# Altium schematic sheet СФ МЭИ ПЭ-25.11.04.04.09.01 Э3.SchDoc
size 594 x 420 mm; CheckedBy: Ковалева М.С.; Author: Чепурин В.Ю.; CompanyName: СФ МЭИ; SheetNumber: 1; SheetTotal: 1; DateCreate: 10.01.26; PageSetup: Record=PageOptions|CenterHorizontal=True|CenterVertical=True|PrintScale=0.94|XCorrection=1.00|YCorrection=1.00|PrintKind=1|BorderSize=5000000|LeftOffset=0|BottomOffset=0|Orientation=1|PaperLength=1000|PaperWidth=1000|Scale=100|PaperSource=7|PrintQuality=-4|MediaType=1|DitherType=10|PaperKind=A4|PrintScaleMode=1; DecimalNumber: СФ МЭИ ПЭ-25.11.04.04.09.01; Name1: Устройство измерения; n_kontr: Ковалева М.С.; lit_A: У; Name2: параметров микроклимата; Name3: с беспроводным интерфейсом; Group: гр. ПЭ-25з(Маг)
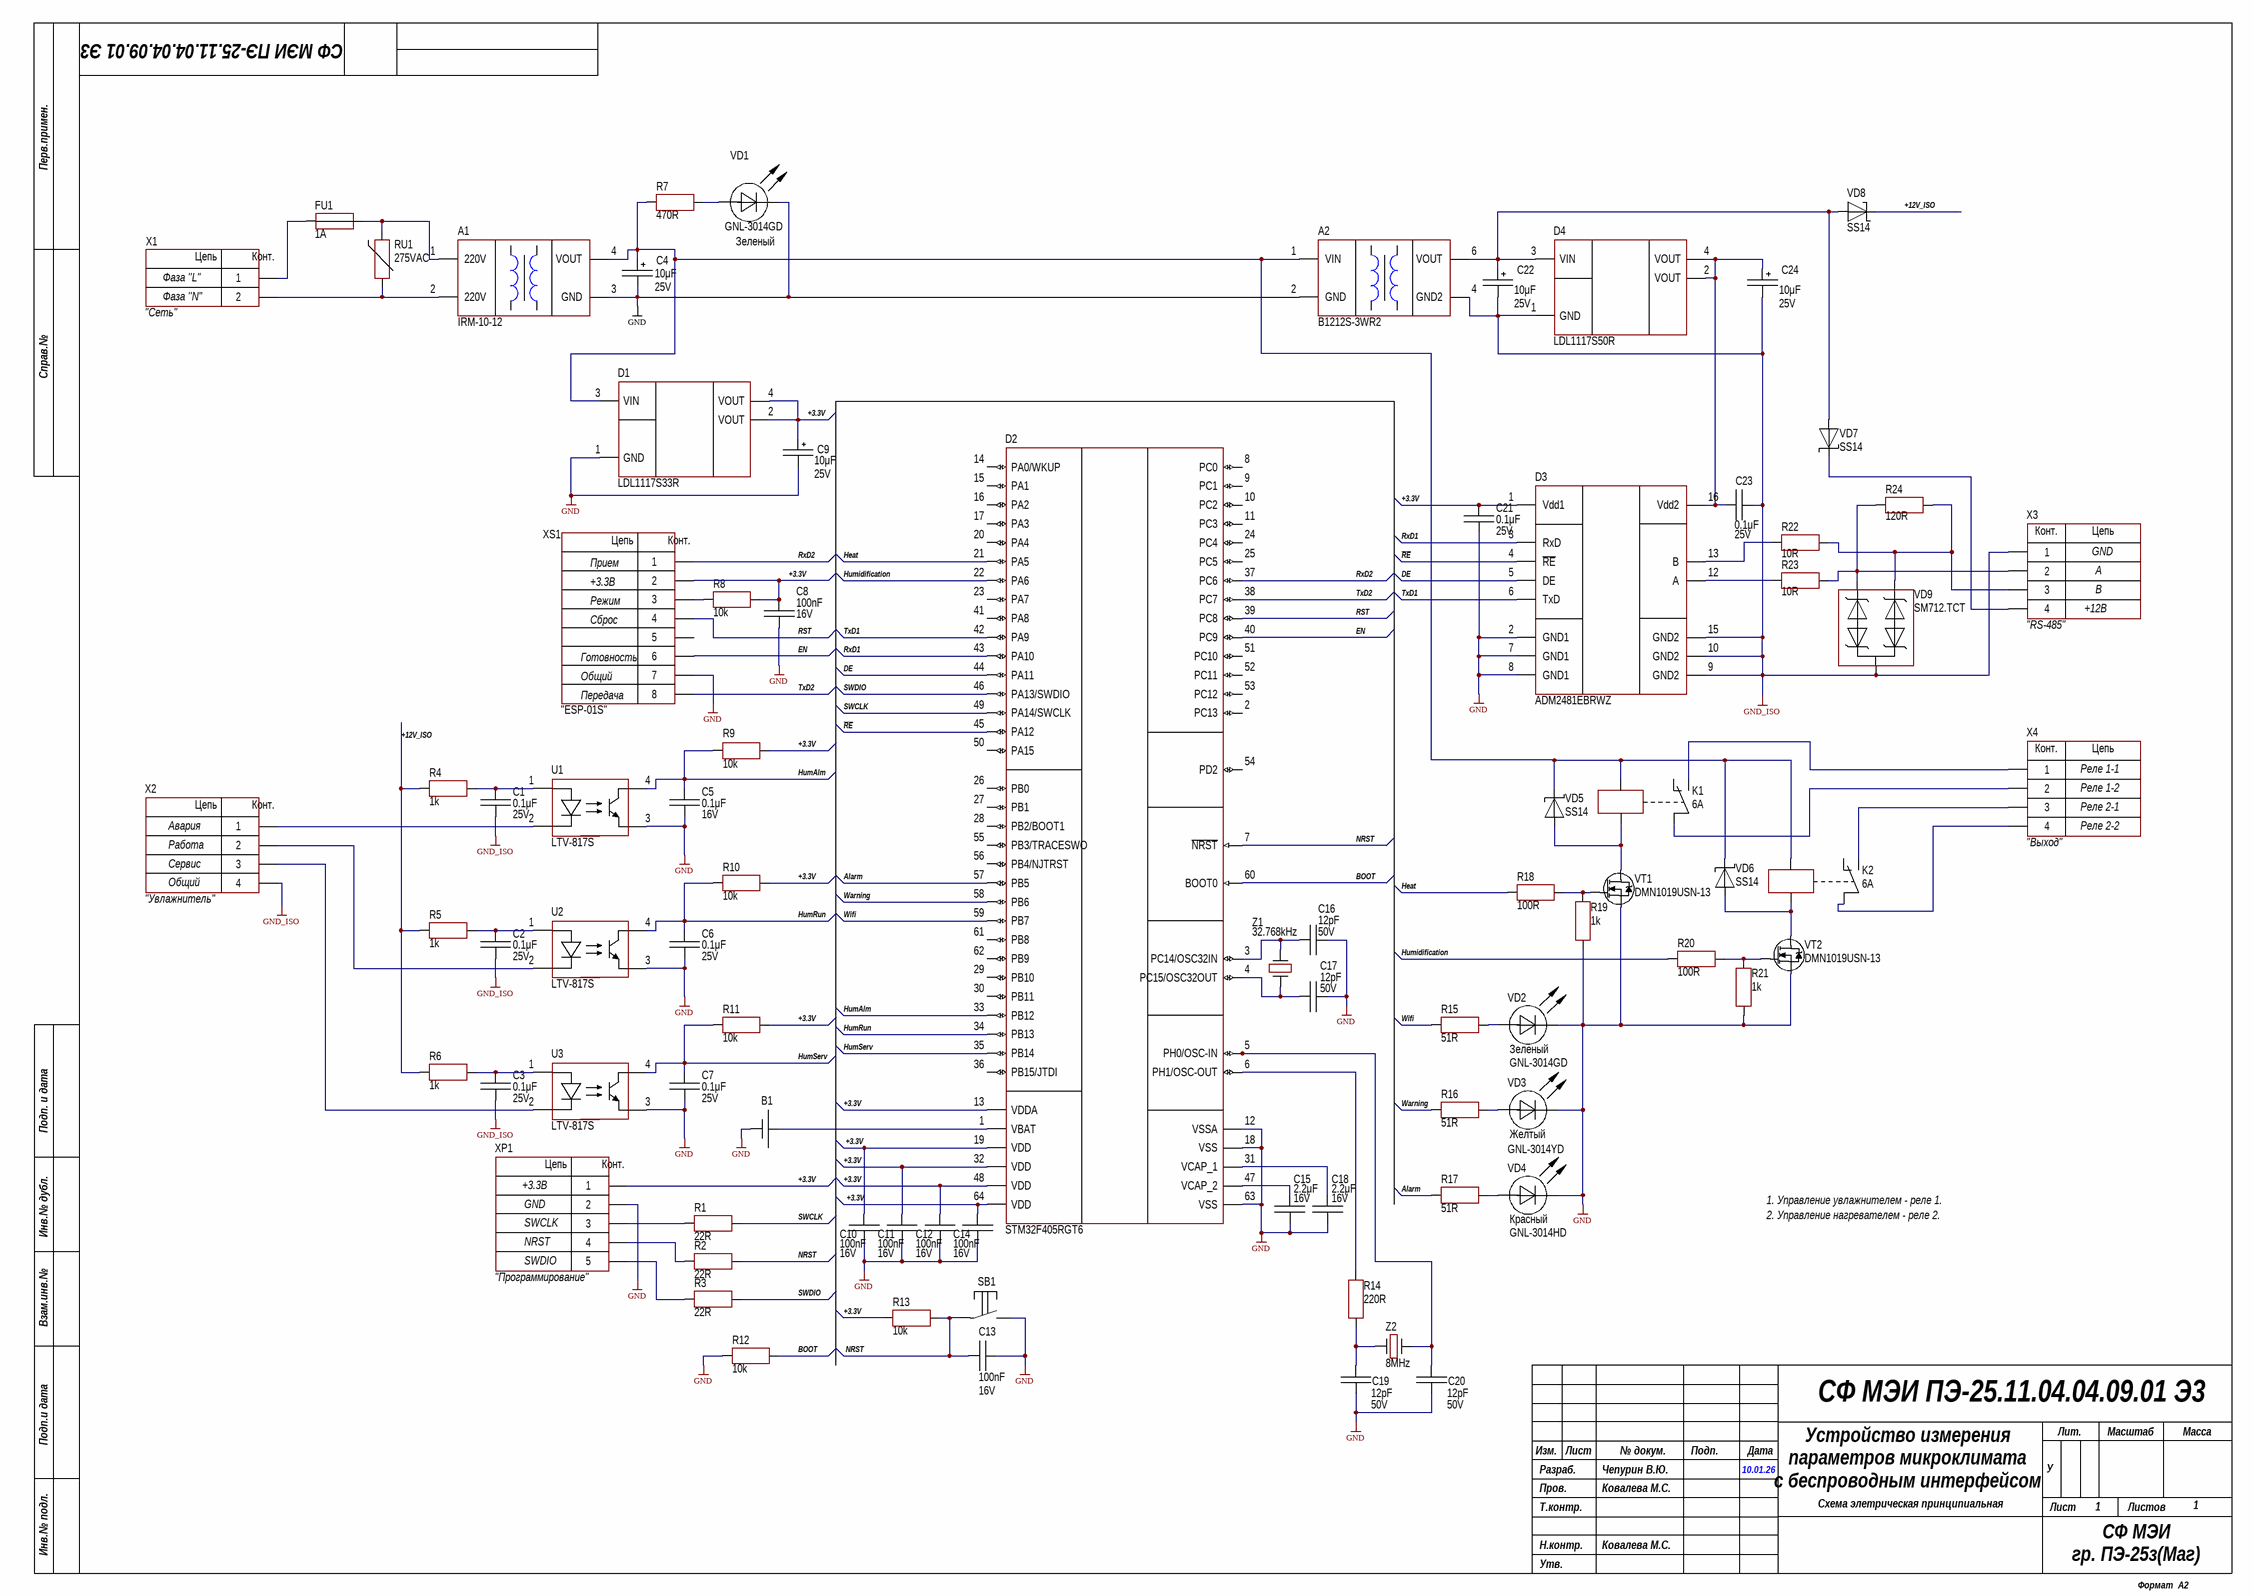
[diagram p0: СФ МЭИ ПЭ-25.11.04.04.09.01 Э3.SchDoc]

## Parts
A1  PartNumber: IRM-10-12  [MOD: IRM-10-12]  (hidden comment: AC/DC converter, isolator, 12V 850mA, 85...265VAC, -30...+70°C, 4-DIP)
A2  PartNumber: B1212S-3WR2  [MOD: SIP-7 (B1212S-2W)]
B1  (no value)  [BAT: CH224-2032]
C1  value 0.1μF  Voltage: 25V  [CAP: 0805]  (hidden comment: Ceramic capacitor, 0.1μF, X7R, ±10%, 16V, 0805, -55...+125°C)
C2  value 0.1μF  Voltage: 25V  [CAP: 0805]  (hidden comment: Ceramic capacitor, 0.1μF, X7R, ±10%, 16V, 0805, -55...+125°C)
C3  value 0.1μF  Voltage: 25V  [CAP: 0805]  (hidden comment: Ceramic capacitor, 0.1μF, X7R, ±10%, 16V, 0805, -55...+125°C)
C4  value 10μF  Voltage: 25V  [CAP: TANTAL-C]
C5  value 0.1μF  Voltage: 16V  [CAP: 0805]
C6  value 0.1μF  Voltage: 25V  [CAP: 0805]  (hidden comment: Ceramic capacitor, 0.1μF, X7R, ±10%, 16V, 0805, -55...+125°C)
C7  value 0.1μF  Voltage: 25V  [CAP: 0805]  (hidden comment: Ceramic capacitor, 0.1μF, X7R, ±10%, 16V, 0805, -55...+125°C)
C8  value 100nF  Voltage: 16V  [CAP: 0805]
C9  value 10μF  Voltage: 25V  [CAP: TANTAL-C]
C10  value 100nF  Voltage: 16V  [CAP: 0805]
C11  value 100nF  Voltage: 16V  [CAP: 0805]
C12  value 100nF  Voltage: 16V  [CAP: 0805]
C13  value 100nF  Voltage: 16V  [CAP: 0805]
C14  value 100nF  Voltage: 16V  [CAP: 0805]
C15  value 2.2μF  Voltage: 16V  [CAP: 0805]
C16  value 12pF  Voltage: 50V  [CAP: 0805]  (hidden comment: Ceramic capacitor, 6.8pF, X7R, ±10%, 16V, 0805, -55...+125°C)
C17  value 12pF  Voltage: 50V  [CAP: 0805]  (hidden comment: Ceramic capacitor, 6.8pF, X7R, ±10%, 16V, 0805, -55...+125°C)
C18  value 2.2μF  Voltage: 16V  [CAP: 0805]
C19  value 12pF  Voltage: 50V  [CAP: 0805]  (hidden comment: Ceramic capacitor, 6.8pF, X7R, ±10%, 16V, 0805, -55...+125°C)
C20  value 12pF  Voltage: 50V  [CAP: 0805]  (hidden comment: Ceramic capacitor, 6.8pF, X7R, ±10%, 16V, 0805, -55...+125°C)
C21  value 0.1μF  Voltage: 25V  [CAP: 0805]  (hidden comment: Ceramic capacitor, 0.1μF, X7R, ±10%, 16V, 0805, -55...+125°C)
C22  value 10μF  Voltage: 25V  [CAP: TANTAL-C]
C23  value 0.1μF  Voltage: 25V  [CAP: 0805]  (hidden comment: Ceramic capacitor, 0.1μF, X7R, ±10%, 16V, 0805, -55...+125°C)
C24  value 10μF  Voltage: 25V  [CAP: TANTAL-C]
D1  (no value)  [SOT223]
D2  (no value)  [64-LQFP]
D3  (no value)  [16-SOIC]
D4  PartNumber: LDL1117S50R  [SOT223]
FU1  Value current: 1A  [FUSE: 01110501Z (5x20 mm)]
K1  Value current: 6A  [REL: Ultra-thin relay, 5pin]
K2  Value current: 6A  [REL: Ultra-thin relay, 5pin]
R1  value 22R  [RES: 0805]
R2  value 22R  [RES: 0805]
R3  value 22R  [RES: 0805]
R4  value 1k  [RES: 0805]  (hidden comment: Resistor film, 560R, ±5%, 0805, 0.125W, -55...+125°C)
R5  value 1k  [RES: 0805]  (hidden comment: Resistor film, 560R, ±5%, 0805, 0.125W, -55...+125°C)
R6  value 1k  [RES: 0805]  (hidden comment: Resistor film, 560R, ±5%, 0805, 0.125W, -55...+125°C)
R7  value 470R  [RES: 0805]
R8  value 10k  [RES: 0805]
R9  value 10k  [RES: 0805]  (hidden comment: Resistor film, 1k, ±5%, 0805, 0.125W, -55...+125°C)
R10  value 10k  [RES: 0805]  (hidden comment: Resistor film, 1k, ±5%, 0805, 0.125W, -55...+125°C)
R11  value 10k  [RES: 0805]  (hidden comment: Resistor film, 1k, ±5%, 0805, 0.125W, -55...+125°C)
R12  value 10k  [RES: 0805]  (hidden comment: Resistor film, 1k, ±5%, 0805, 0.125W, -55...+125°C)
R13  value 10k  [RES: 0805]
R14  value 220R  [RES: 0805]
R15  value 51R  [RES: 0805]
R16  value 51R  [RES: 0805]
R17  value 51R  [RES: 0805]
R18  value 100R  [RES: 0805]
R19  value 1k  [RES: 0805]
R20  value 100R  [RES: 0805]
R21  value 1k  [RES: 0805]
R22  value 10R  [RES: 0805]
R23  value 10R  [RES: 0805]
R24  value 120R  [RES: 0805]
RU1  MaxVoltage: 275VAC  [RES: MOV-07D431K]
SB1  (no value)  [BUT: 6x6]
U1  PartNumber: LTV-817S  [4-SMD]
U2  PartNumber: LTV-817S  [4-SMD]
U3  PartNumber: LTV-817S  [4-SMD]
VD1  Color: Зеленый  [LED: Green, 3mm]
VD2  Color: Зеленый  [LED: Green, 3mm]
VD3  Color: Желтый  [LED: Yellow, 3mm]
VD4  Color: Красный  [LED: Red, 3mm]
VD5  (no value)  [DIODE: SMA]
VD6  (no value)  [DIODE: SMA]
VD7  (no value)  [DIODE: SMA]
VD8  (no value)  [DIODE: SMA]
VD9  (no value)  [SOT23]
VT1  (no value)  [SOT23]
VT2  (no value)  [SOT23]
X1  CommentText: "Сеть"  [CON: DG301-5.0-02P-12]
X2  CommentText: "Увлажнитель"  [CON: DG301-5.0-02P-12x2]
X3  CommentText: "RS-485"  [CON: DG301-5.0-02P-12x2]
X4  CommentText: "Выход"  [CON: DG301-5.0-02P-12x2]
XP1  CommentText: "Программирование"  [CON: PLS-5]
XS1  CommentText: "ESP-01S"  [CON: PBD-8]
Z1  Frequency: 32.768kHz  [OSC: 3215]
Z2  Frequency: 8MHz  [OSC: НС-49S]

## Nets
GND: A1.3(GND) A2.2(GND) B1.2(-) C4.2 C5.1 C6.1 C7.1 C8.1 C9.2 C10.1 C11.1 C12.1 C13.1 C14.1 C15.1 C16.2 C17.2 C18.1 C19.2 C20.2 C21.1 D1.1(GND) D2.12(VSSA) D2.18(VSS) D2.63(VSS) D3.2(GND1) D3.7(GND1) D3.8(GND1) R12.2 R19.2 R21.2 SB1.2 U1.3(E) U2.3(E) U3.3(E) VD1.2(C) VD2.2(C) VD3.2(C) VD4.2(C) VT1.2(S) VT2.2(S) XP1.2 XS1.7
GND_ISO: A2.4(GND2) C1.1 C2.1 C3.1 C22.2 C23.1 C24.2 D3.9(GND2) D3.10(GND2) D3.15(GND2) D4.1(GND) VD9.3 X2.4 X3.1
+3.3V: C8.2 C9.1 C10.2 C11.2 C12.2 C14.2 C21.2 D1.2(VOUT) D1.4(VOUT) D2.13(VDDA) D2.19(VDD) D2.32(VDD) D2.48(VDD) D2.64(VDD) D3.1(Vdd1) R8.1 R9.1 R10.1 R11.1 R13.2 XP1.1 XS1.2
+12V_ISO: R4.2 R5.2 R6.2 VD8.2
Alarm: D2.57(PB5) R17.2
BOOT: D2.60(BOOT0) R12.1
DE: D2.44(PA11) D3.5(DE)
EN: D2.40(PC9) XS1.6
Heat: D2.21(PA5) R18.2
HumAlm: C5.2 D2.33(PB12) R9.2 U1.4(C)
Humidification: D2.22(PA6) R20.2
HumRun: C6.2 D2.34(PB13) R10.2 U2.4(C)
HumServ: C7.2 D2.35(PB14) R11.2 U3.4(C)
NRST: C13.2 D2.7(~{NRST}) R2.1 R13.1 SB1.1
~{RE}: D2.45(PA12) D3.4(~{RE})
RST: D2.39(PC8) XS1.4
RxD1: D2.43(PA10) D3.3(RxD)
RxD2: D2.37(PC6) XS1.1
SWCLK: D2.49(PA14/SWCLK) R1.1
SWDIO: D2.46(PA13/SWDIO) R3.1
TxD1: D2.42(PA9) D3.6(TxD)
TxD2: D2.38(PC7) XS1.8
Warning: D2.58(PB6) R16.2
Wifi: D2.59(PB7) R15.2
NetA1_1: A1.1(220V) FU1.2 RU1.2
NetA1_2: A1.2(220V) RU1.1 X1.2
NetA1_4: A1.4(VOUT) A2.1(VIN) C4.1 D1.3(VIN) K1.2 K2.2 R7.2 VD5.2 VD6.2
NetA2_6: A2.6(VOUT) C22.1 D4.3(VIN) VD7.1 VD8.1
NetB1_1: B1.1(+) D2.1(VBAT)
NetC1_2: C1.2 R4.1 U1.1(A)
NetC2_2: C2.2 R5.1 U2.1(A)
NetC3_2: C3.2 R6.1 U3.1(A)
NetC15_2: C15.2 D2.47(VCAP_2)
NetC16_1: C16.1 D2.3(PC14/OSC32IN) Z1.2
NetC17_1: C17.1 D2.4(PC15/OSC32OUT) Z1.1
NetC18_2: C18.2 D2.31(VCAP_1)
NetC19_1: C19.1 R14.2 Z2.1
NetC20_1: C20.1 D2.5(PH0/OSC-IN) Z2.2
NetC23_2: C23.2 C24.1 D3.16(Vdd2) D4.2(VOUT) D4.4(VOUT)
NetD2_6: D2.6(PH1/OSC-OUT) R14.1
NetD3_12: D3.12(A) R23.2
NetD3_13: D3.13(B) R22.2
NetFU1_1: FU1.1 X1.1
NetK1_1: K1.1 VD5.1 VT1.3(D)
NetK1_3: K1.3 X4.2
NetK1_5: K1.5 X4.1
NetK2_1: K2.1 VD6.1 VT2.3(D)
NetK2_3: K2.3 X4.4
NetK2_5: K2.5 X4.3
NetR1_2: R1.2 XP1.3
NetR2_2: R2.2 XP1.4
NetR3_2: R3.2 XP1.5
NetR7_1: R7.1 VD1.1(A)
NetR8_2: R8.2 XS1.3
NetR15_1: R15.1 VD2.1(A)
NetR16_1: R16.1 VD3.1(A)
NetR17_1: R17.1 VD4.1(A)
NetR18_1: R18.1 R19.1 VT1.1(G)
NetR20_1: R20.1 R21.1 VT2.1(G)
NetR22_1: R22.1 R24.1 VD9.2 X3.3
NetR23_1: R23.1 R24.2 VD9.1 X3.2
NetU1_2: U1.2(C) X2.1
NetU2_2: U2.2(C) X2.2
NetU3_2: U3.2(C) X2.3
NetVD7_2: VD7.2 X3.4

Not connected (* = marked no-connect by the designer): D2 2(PC13) 8(PC0) 9(PC1) 10(PC2) 11(PC3) 14(PA0/WKUP) 15(PA1) 16(PA2) 17(PA3) 20(PA4) 23(PA7) 24(PC4) 25(PC5) 26(PB0) 27(PB1) 28(PB2/BOOT1) 29(PB10) 30(PB11) 36(PB15/JTDI) 41(PA8) 50(PA15) 51(PC10) 52(PC11) 53(PC12) 54(PD2) 55(PB3/TRACESWO) 56(PB4/NJTRST) 61(PB8) 62(PB9); K1 4; K2 4; XS1 5

## Notes on the sheet
- Фаза ''L"
- Фаза ''N"
- +3.3В
- Прием
- GND
- A
- B
- Сброс
- Режим
- +12В
- Общий
- Передача
- (near XS1) Готовность
- Реле 1-1
- Реле 1-2
- Авария
- Реле 2-1
- Реле 2-2
- Сервис
- Работа
- SWCLK
- 1. Управление увлажнителем - реле 1.
- 2. Управление нагревателем - реле 2.
- SWDIO
- NRST
- Перв.примен.
- Справ.№
- Подп. и дата
- Инв.№ дубл.
- Взам.инв.№
- Подп.и дата
- Разраб.
- Изм.
- Лист
- № докум.
- Подп.
- Дата
- Лит.
- Масштаб
- Масса
- Т.контр.
- Пров.
- Схема элетрическая принципиальная
- Листов
- Инв.№ подл.
- Утв.
- Н.контр.
- Формат  A2
- (in symbol Connector_terminal_2pin) Цепь; Конт.
- (in symbol Connector_terminal_4pin) Конт.; Цепь
- (in symbol PBD-8) Цепь; Конт.
- (in symbol PLS-5) Цепь; Конт.

## Library data of the parts
A1 = IRM-20-12: AC/DC converter; Manufacturer: MEAN WELL; ValueManufacturerPartNumber: AC/DC converter, isolator, 12V 1.8A, 85...265VAC, -30...+70°C, 4-DIP; OutputVoltage: 12V 1.8A; HelpURL: https://www.digikey.com/products/en?keywords=IRM-20-12; Package: 4-DIP; ComponentType: AC/DC converter; OutputType: isolator; Temperature: -30...+70°C; InputVoltage: 85...265VAC
A2 = B1212S-2WR2: DC/DC converter; Manufacturer: Mornsun; ValueManufacturerPartNumber: DC/DC converter, isolator, 12V 167mA, -40...+105°C, SIP-7; OutputType: isolator; OutputVoltage: 12V 167mA; HelpURL: https://www.compel.ru/infosheet/MORNSUN/B1212S-2WR2; Package: SIP-7; ComponentType: DC/DC converter; Temperature: -40...+105°C
B1 = Connector_CH224-2032: Manufacturer: KLS; ValueManufacturerPartNumber: Single battery CR2032; CommentText: CR2032; HelpURL: https://www.chipdip.ru/product/bh-642; TypeConnector: Single battery CR2032; PartNumber: CH224-2032
C1-C3 C6 C7 C21 C23 = Ceramic_0805: Manufacturer: Yageo; PartNumber: CC0805KRX7R7BB104; ValueManufacturerPartNumber: Ceramic capacitor, 0.1μF, X7R, ±10%, 25V, 0805, -55...+125°C; Package: 0805; HelpURL: https://www.digikey.com/product-detail/en/yageo/CC0805KRX7R7BB104/311-1142-1-ND/303052; Temperature: -55...+125°C; TypeCapacitor: Ceramic capacitor; Tolerance: ±10%; TypeDielectric: X7R
C4 C9 C22 C24 = Tantal_C: Manufacturer: AVX; PartNumber: F931E106MCC; ValueManufacturerPartNumber: Tantalum capacitor, 10μF, 25V, ±10%, 1.1Ohm, case C (6032), -55...+125°C; Impedance: 1.1Ohm; Tolerance: ±10%; TypeDielectric: X7R; TypeCapacitor: Tantalum capacitor; Package: case C (6032); HelpURL: https://www.digikey.com/product-detail/en/avx-corporation/F931E226MCC/478-8314-1-ND/4006045; Temperature: -55...+125°C
C5 = Ceramic_0805: Manufacturer: Yageo; PartNumber: CC0805KRX7R7BB104; ValueManufacturerPartNumber: Ceramic capacitor, 0.1μF, X7R, ±10%, 16V, 0805, -55...+125°C; TypeCapacitor: Ceramic capacitor; Tolerance: ±10%; TypeDielectric: X7R; Package: 0805; HelpURL: https://www.digikey.com/product-detail/en/yageo/CC0805KRX7R7BB104/311-1142-1-ND/303052; Temperature: -55...+125°C
C8 C10-C14 = Ceramic_0805: Manufacturer: Yageo; PartNumber: CC0805KRX7R7BB104; ValueManufacturerPartNumber: Ceramic capacitor, 100nF, X7R, ±10%, 16V, 0805, -55...+125°C; TypeCapacitor: Ceramic capacitor; Tolerance: ±10%; TypeDielectric: X7R; Package: 0805; HelpURL: https://www.digikey.com/product-detail/en/yageo/CC0805KRX7R7BB104/311-1142-1-ND/303052; Temperature: -55...+125°C
C15 C18 = Ceramic_0805: Manufacturer: Yageo; PartNumber: CC0805KRX7R7BB104; ValueManufacturerPartNumber: Ceramic capacitor, 2.2μF, X7R, ±10%, 16V, 0805, -55...+125°C; TypeCapacitor: Ceramic capacitor; Tolerance: ±10%; TypeDielectric: X7R; Package: 0805; HelpURL: https://www.digikey.com/product-detail/en/yageo/CC0805KRX7R7BB104/311-1142-1-ND/303052; Temperature: -55...+125°C
C16 C17 C19 C20 = Ceramic_0805: Manufacturer: Yageo; PartNumber: CC0805KRX7R7BB104; ValueManufacturerPartNumber: Ceramic capacitor, 12pF, X7R, ±10%, 50V, 0805, -55...+125°C; Package: 0805; HelpURL: https://www.digikey.com/product-detail/en/yageo/CC0805KRX7R7BB104/311-1142-1-ND/303052; Temperature: -55...+125°C; TypeCapacitor: Ceramic capacitor; Tolerance: ±10%; TypeDielectric: X7R
D1 D4 = LDL1117S33R: Linear voltage regulator; Manufacturer: STMicroelectronics; ValueManufacturerPartNumber: Linear voltage regulator, input 3.9...18V, 0.6V, output 3.3V, 1.2A, -40...+85°C, SOT223; VoltageInput: input 3.9...18V; MaxDropout: 0.6V; CurrentOutput: 1.2A; VoltageOutput: output 3.3V; HelpURL: https://www.digikey.com/product-detail/en/stmicroelectronics/LDL1117S33R/497-17239-1-ND/7102079; Package: SOT223; ComponentType: Linear voltage regulator; Temperature: -40...+85°C
  D1: PartNumber: LDL1117S33R
D2 = STM32F405RGT6: Cortex-M4; Manufacturer: STMicroelectronics; ValueManufacturerPartNumber: IC microcontroller, 32-Bit, Cortex-M4, 168MHz, 1024KB, 192KB, 2...3.6V, -40...+85°C, 64-LQFP; Supply: 2...3.6V; Speed: 168MHz; CoreSize: 32-Bit; MemoryROM: 1024KB; MemoryRAM: 192KB; HelpURL: https://www.digikey.com/product-detail/en/stmicroelectronics/STM32F334R8T6/497-14955-ND/4989177; Package: 64-LQFP; ComponentType: IC microcontroller; Temperature: -40...+85°C; CoreProcessor: Cortex-M4; PartNumber: STM32F405RGT6
D3 = ADM2481EBRWZ: Signal Isolated RS-485; Manufacturer: Analog Devices; ValueManufacturerPartNumber: Signal Isolated, 500Kbps, 2500Vrms, 3...5.5V, -40...+85°C, SOIC-16W; Supply: 3...5.5V; DataRate: 500Kbps; Isolation: 2500Vrms; HelpURL: https://static.chipdip.ru/lib/424/DOC001424716.pdf; Package: SOIC-16W; ComponentType: Signal Isolated; Temperature: -40...+85°C; PartNumber: ADM2481EBRWZ
FU1 = ВП4 -3: Fuse; Manufacturer: ОАО "Радиодеталь"; PartNumber: ВПТ6-20, 1А, 250В; Temperature: -60...+70°C
K1 K2 = 34.51.7.012.0010: Relay; Manufacturer: Finder; Rated voltage: 250VAC; Control voltage: 12VDC; Number of groups: 1; PartNumber: 34.51.7.012.0010; Temperature: -40...+85°C
R1-R3 = Resistor_0805: Manufacturer: Yageo; PartNumber: RC0805JR-07100RL; ValueManufacturerPartNumber: Resistor film, 22R, ±5%, 0805, 0.125W, -55...+125°C; TypeResistor: Resistor film; Power: 0.125W; Tolerance: ±5%; Package: 0805; HelpURL: https://www.digikey.com/product-detail/en/yageo/RC0805JR-07100RL/311-100ARCT-ND/731185; Temperature: -55...+125°C
R4-R6 = Resistor_0805: Manufacturer: Yageo; PartNumber: RC0805JR-07100RL; ValueManufacturerPartNumber: Resistor film, 1k, ±5%, 0805, 0.125W, -55...+125°C; Package: 0805; HelpURL: https://www.digikey.com/product-detail/en/yageo/RC0805JR-07100RL/311-100ARCT-ND/731185; Temperature: -55...+125°C; TypeResistor: Resistor film; Power: 0.125W; Tolerance: ±5%
R7 = Resistor_0805: Manufacturer: Yageo; PartNumber: RC0805JR-07100RL; ValueManufacturerPartNumber: Resistor film, 470R, ±5%, 0805, 0.125W, -55...+125°C; TypeResistor: Resistor film; Power: 0.125W; Tolerance: ±5%; Package: 0805; HelpURL: https://www.digikey.com/product-detail/en/yageo/RC0805JR-07100RL/311-100ARCT-ND/731185; Temperature: -55...+125°C
R8 R13 = Resistor_0805: Manufacturer: Yageo; PartNumber: RC0805JR-07100RL; ValueManufacturerPartNumber: Resistor film, 10k, ±5%, 0805, 0.125W, -55...+125°C; TypeResistor: Resistor film; Power: 0.125W; Tolerance: ±5%; Package: 0805; HelpURL: https://www.digikey.com/product-detail/en/yageo/RC0805JR-07100RL/311-100ARCT-ND/731185; Temperature: -55...+125°C
R9-R12 = Resistor_0805: Manufacturer: Yageo; PartNumber: RC0805JR-07100RL; ValueManufacturerPartNumber: Resistor film, 10k, ±5%, 0805, 0.125W, -55...+125°C; Package: 0805; HelpURL: https://www.digikey.com/product-detail/en/yageo/RC0805JR-07100RL/311-100ARCT-ND/731185; Temperature: -55...+125°C; TypeResistor: Resistor film; Power: 0.125W; Tolerance: ±5%
R14 = Resistor_0805: Manufacturer: Yageo; PartNumber: RC0805JR-07100RL; ValueManufacturerPartNumber: Resistor film, 220R, ±5%, 0805, 0.125W, -55...+125°C; TypeResistor: Resistor film; Power: 0.125W; Tolerance: ±5%; Package: 0805; HelpURL: https://www.digikey.com/product-detail/en/yageo/RC0805JR-07100RL/311-100ARCT-ND/731185; Temperature: -55...+125°C
R15-R17 = Resistor_0805: Manufacturer: Yageo; PartNumber: RC0805JR-07100RL; ValueManufacturerPartNumber: Resistor film, 51R, ±5%, 0805, 0.125W, -55...+125°C; TypeResistor: Resistor film; Power: 0.125W; Tolerance: ±5%; Package: 0805; HelpURL: https://www.digikey.com/product-detail/en/yageo/RC0805JR-07100RL/311-100ARCT-ND/731185; Temperature: -55...+125°C
R18 R20 = Resistor_0805: Manufacturer: Yageo; PartNumber: RC0805JR-07100RL; ValueManufacturerPartNumber: Resistor film, 100R, ±5%, 0805, 0.125W, -55...+125°C; TypeResistor: Resistor film; Power: 0.125W; Tolerance: ±5%; Package: 0805; HelpURL: https://www.digikey.com/product-detail/en/yageo/RC0805JR-07100RL/311-100ARCT-ND/731185; Temperature: -55...+125°C
R19 R21 = Resistor_0805: Manufacturer: Yageo; PartNumber: RC0805JR-07100RL; ValueManufacturerPartNumber: Resistor film, 1k, ±5%, 0805, 0.125W, -55...+125°C; TypeResistor: Resistor film; Power: 0.125W; Tolerance: ±5%; Package: 0805; HelpURL: https://www.digikey.com/product-detail/en/yageo/RC0805JR-07100RL/311-100ARCT-ND/731185; Temperature: -55...+125°C
R22 R23 = Resistor_0805: Manufacturer: Yageo; PartNumber: RC0805JR-07100RL; ValueManufacturerPartNumber: Resistor film, 10R, ±5%, 0805, 0.125W, -55...+125°C; TypeResistor: Resistor film; Power: 0.125W; Tolerance: ±5%; Package: 0805; HelpURL: https://www.digikey.com/product-detail/en/yageo/RC0805JR-07100RL/311-100ARCT-ND/731185; Temperature: -55...+125°C
R24 = Resistor_0805: Manufacturer: Yageo; PartNumber: RC0805JR-07100RL; ValueManufacturerPartNumber: Resistor film, 120R, ±5%, 0805, 0.125W, -55...+125°C; TypeResistor: Resistor film; Power: 0.125W; Tolerance: ±5%; Package: 0805; HelpURL: https://www.digikey.com/product-detail/en/yageo/RC0805JR-07100RL/311-100ARCT-ND/731185; Temperature: -55...+125°C
RU1 = Varistor: Manufacturer: Bourns; PartNumber: MOV-07D431KTR; ValueManufacturerPartNumber: Varistor, 275VAC, pitch 7mm, -55...+125°C; Package: pitch 7mm; HelpURL: https://www.digikey.com/product-detail/en/bourns-inc/MOV-07D431KTR/MOV-07D431KTRCT-ND/4318145; Temperature: -55...+125°C; TypeResistor: Varistor
SB1 = FSM16JH: Кнопка тактовая h=17 мм SPST; Manufacturer: TE Connectivity; Current: 0.05A; Voltage: 24V; PartNumber: FSM16JH; Temperature: -35...+85°C
U1-U3 = LTV-817: Optoisolator; Manufacturer: Lite-On; ValueManufacturerPartNumber: IC optoisolator, 4µs/3µs, 5000Vrms, 35V, -40...+125°C, 4-SMD; Supply: 35V; DataRate: 4µs/3µs; Isolation: 5000Vrms; HelpURL: https://www.digikey.com/product-detail/en/lite-on-inc/LTV-817S/160-1367-5-ND/385837; Package: 4-SMD; ComponentType: IC optoisolator; Temperature: -40...+125°C
VD1 VD2 = GNL-3014GD: Светодиод зеленый 60° d=3мм 30-50мКд 565нМ; Manufacturer: G-nor Electronics; ValueManufacturerPartNumber: LED, Green, *, *, *, -40...+80°C; TypeDiode: LED; ColorParameter: Green; Wavelength: 565nm; Package: *; HelpURL: *; Temperature: -40...+80°C; Current: *; VoltageDrop: *; PartNumber: GNL-3014GD
VD3 = GNL-3014YD: Светодиод желтый 60° d=3мм 15мКд 585нМ; Manufacturer: G-nor Electronics; ValueManufacturerPartNumber: LED, Yellow, *, *, *, -40...+80°C; TypeDiode: LED; ColorParameter: Yellow; Wavelength: 585nm; Package: *; HelpURL: *; Temperature: -40...+80°C; Current: *; VoltageDrop: *; PartNumber: GNL-3014YD
VD4 = GNL-3014HD: Светодиод красный 60° d=3мм 5-10мКд 700нМ; Manufacturer: G-nor Electronics; ValueManufacturerPartNumber: LED, Red, *, *, *, -40...+80°C; TypeDiode: LED; ColorParameter: Red; Wavelength: 700nm; Package: *; HelpURL: *; Temperature: -40...+80°C; Current: *; VoltageDrop: *; PartNumber: GNL-3014HD
VD5-VD8 = SS14: Schottky Rectifier; Manufacturer: ON Semiconductor; TypeDiode: Schottky diode; Voltage: 40V; Current: 1A; VoltageDrop: 1V; Package: SOD-123; HelpURL: https://static.chipdip.ru/lib/641/DOC001641727.pdf; ValueManufacturerPartNumber: =TypeDiode+', '+Voltage+', '+Current+', '+VoltageDrop+', '+RecoveryTime+', '+Package+', '+Temperature; Temperature: -65...+150°C; PartNumber: SS14
VD9 = SM712.TCT: Asymmetrical TVS Diode for Extended Common-Mode RS-485; Manufacturer: Diodes Incorporated; TypeDiode: Zener diode; Voltage: +12V, -7V; Package: SOT23; HelpURL: https://static.chipdip.ru/lib/075/DOC034075942.pdf; ValueManufacturerPartNumber: =TypeDiode+', '+Voltage+', '+Current+', '+VoltageDrop+', '+RecoveryTime+', '+Package+', '+Temperature; Temperature: -55...+150°C; PartNumber: SM712.TCT
VT1 VT2 = DMN1019USN-13: Manufacturer: Infineon Technologies; ValueManufacturerPartNumber: MOSFET N-channel transistor, 12V, 9.3A, 16.8nC, 680mW, 10mOhm, 2426 pF @ 10 V, 8-TDSON, -55...+150°C; TypeTransistor: MOSFET N-channel transistor; VoltageDS: 12V; CurrentDS: 9.3A; RDS: 10mOhm; GateCharge: 16.8nC; InputCapacitor: 2426 pF @ 10 V; MaxPower: 680mW; Package: 8-TDSON; HelpURL: https://static.chipdip.ru/lib/701/DOC011701306.pdf; Temperature: -55...+150°C; PartNumber: DMN1019USN-13
X1 = Connector_terminal_2pin: Manufacturer: Degson; ValueManufacturerPartNumber: Terminal connector, 2pin, 3.5mm, 300VAC, 10A; PartNumber: DG350-3.5-02P-14; TypeConnector: Terminal connector; VoltageMax: 300VAC; Pitch: 3.5mm; CurrentMax: 10A; Multichannel: 2pin; HelpURL: https://www.chipdip.ru/product/dg350-3.5-02p-12
X2-X4 = Connector_terminal_4pin: Manufacturer: Degson; ValueManufacturerPartNumber: Terminal connector, 4pin, 3.5mm, 300VAC, 10A; PartNumber: DG350-3.5-02P-14 x2; TypeConnector: Terminal connector; VoltageMax: 300VAC; Pitch: 3.5mm; CurrentMax: 10A; Multichannel: 4pin; HelpURL: https://www.chipdip.ru/product/dg350-3.5-02p-12
XP1 = PLS-5: Manufacturer: Connfly; ValueManufacturerPartNumber: Connector, 5pin, 2.54mm, 500VAC, 3A; TypeConnector: Connector; VoltageMax: 500VAC; Pitch: 2.54mm; CurrentMax: 3A; Multichannel: 5pin; HelpURL: https://www.chipdip.ru/product/pls-5; PartNumber: PLS-5
XS1 = PBD-8: Manufacturer: Connfly; ValueManufacturerPartNumber: Connector, 8pin, 2.54mm, 500VAC, 3A; TypeConnector: Connector; VoltageMax: 500VAC; Pitch: 2.54mm; CurrentMax: 3A; Multichannel: 8pin; HelpURL: https://www.chipdip.ru/product/pbd-8; PartNumber: PBD-8
Z1 = Crystal_3215: Manufacturer: Epson; PartNumber: CM315D32768DZFT; ValueManufacturerPartNumber: Crystal, 32.768kHz, 12.5pF, ±20ppm, case 3215, -40...+85°C; LoadCapacitance: 12.5pF; Tolerance: ±20ppm; Package: case 3215; HelpURL: https://static.chipdip.ru/lib/427/DOC011427864.pdf; Temperature: -40...+85°C; TypeOscilator: Crystal
Z2 = Crystal_НС-49S: Manufacturer: Epson; PartNumber: SJK-6B-8.000-16-30-50-C-50-H; ValueManufacturerPartNumber: Crystal, 8MHz, 16pF, ±20ppm, HC-49S, -40...+85°C; LoadCapacitance: 16pF; Tolerance: ±20ppm; Package: HC-49S; HelpURL: https://static.chipdip.ru/lib/086/DOC053086622.pdf; Temperature: -40...+85°C; TypeOscilator: Crystal